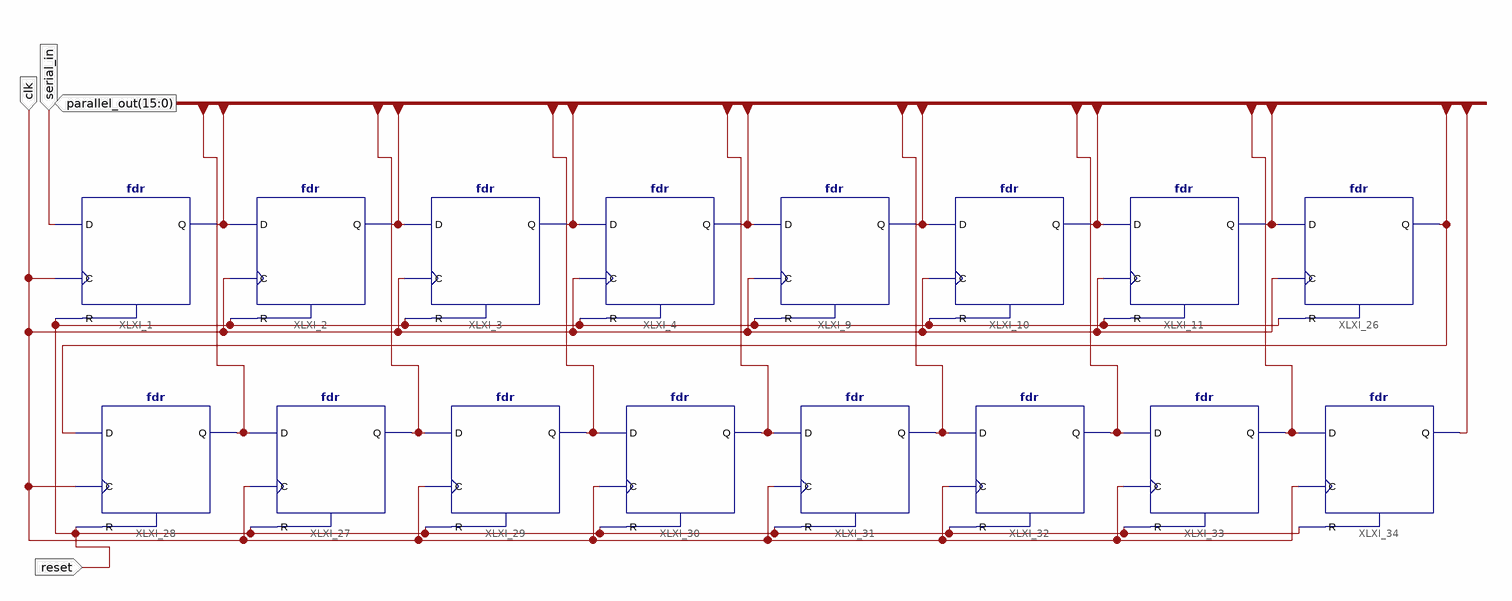
[diagram p0: schematic sheet 1]
// Xilinx ISE schematic sipo16.sch (spartan6) as structural Verilog: 16 symbols, 4 ports
module sipo16 (
  input  reset,
  input  clk,
  input  serial_in,
  output [15:0] parallel_out
);

  fdr XLXI_2 (.C(clk), .D(parallel_out[0]), .R(reset), .Q(parallel_out[1]));
  fdr XLXI_1 (.C(clk), .D(serial_in), .R(reset), .Q(parallel_out[0]));
  fdr XLXI_3 (.C(clk), .D(parallel_out[1]), .R(reset), .Q(parallel_out[2]));
  fdr XLXI_4 (.C(clk), .D(parallel_out[2]), .R(reset), .Q(parallel_out[3]));
  fdr XLXI_9 (.C(clk), .D(parallel_out[3]), .R(reset), .Q(parallel_out[4]));
  fdr XLXI_10 (.C(clk), .D(parallel_out[4]), .R(reset), .Q(parallel_out[5]));
  fdr XLXI_11 (.C(clk), .D(parallel_out[5]), .R(reset), .Q(parallel_out[6]));
  fdr XLXI_26 (.C(clk), .D(parallel_out[6]), .R(reset), .Q(parallel_out[7]));
  fdr XLXI_27 (.C(clk), .D(parallel_out[8]), .R(reset), .Q(parallel_out[9]));
  fdr XLXI_28 (.C(clk), .D(parallel_out[7]), .R(reset), .Q(parallel_out[8]));
  fdr XLXI_29 (.C(clk), .D(parallel_out[9]), .R(reset), .Q(parallel_out[10]));
  fdr XLXI_30 (.C(clk), .D(parallel_out[10]), .R(reset), .Q(parallel_out[11]));
  fdr XLXI_31 (.C(clk), .D(parallel_out[11]), .R(reset), .Q(parallel_out[12]));
  fdr XLXI_32 (.C(clk), .D(parallel_out[12]), .R(reset), .Q(parallel_out[13]));
  fdr XLXI_33 (.C(clk), .D(parallel_out[13]), .R(reset), .Q(parallel_out[14]));
  fdr XLXI_34 (.C(clk), .D(parallel_out[14]), .R(reset), .Q(parallel_out[15]));
endmodule
